# Altium schematic sheet pn532.SchDoc
size A4
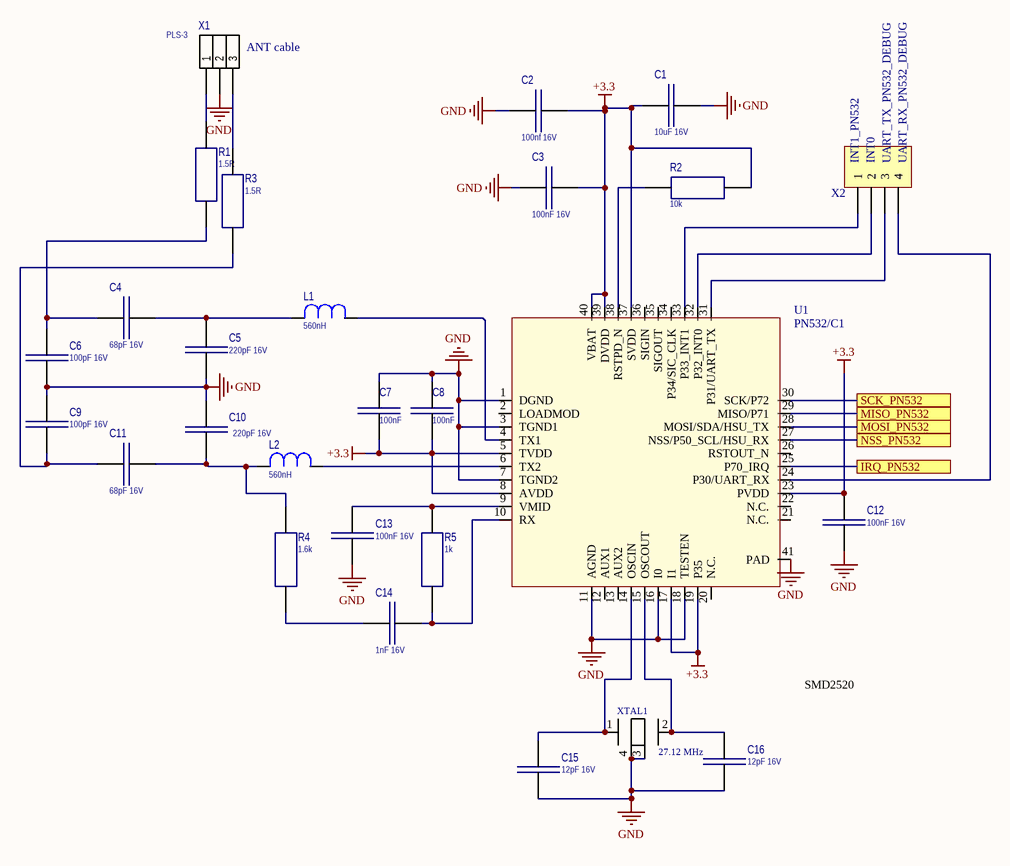
[diagram p0: pn532.SchDoc]

## Parts
C1  10uF 16V  [C_0805]
C2  100nf 16V  [C_0805]
C3  100nF 16V  [C_0805]
C4  68pF 16V  [C_0805]
C5  220pF 16V  [C_0805]
C6  100pF 16V  [C_0805]
C7  100nF  [C_0805]
C8  100nF  [C_0805]
C9  100pF 16V  [C_0805]
C10  220pF 16V  [C_0805]
C11  68pF 16V  [C_0805]
C12  100nF 16V  [C_0805]
C13  100nF 16V  [C_0805]
C14  1nF 16V  [C_0805]
C15  12pF 16V  [C_0805]
C16  12pF 16V  [C_0805]
L1  560nH  [L_0805]
L2  560nH  [L_0805]
R1  1.5R  [R_0805]
R2  10k  [R_0805]
R3  1.5R  [R_0805]
R4  1.6k  [R_0805]
R5  1k  [R_0805]
U1  PN532/C1  [NXP-HVQFN-40_L]
X1  PLS-3  [PLS-3-3D]
X2  PLS-4  [PLS-4-3D]  (value not drawn)
XTAL1  27.12 MHz  [NX2520SA]

## Ports
IRQ_PN532, MISO_PN532, MOSI_PN532, NSS_PN532, SCK_PN532

## Nets
+3.3: C1.2 C2.1 C3.1 C7.1 C8.1 C12.2 R2.1 U1.5(TVDD) U1.8(AVDD) U1.17(I1) U1.19(P35) U1.23(PVDD) U1.37(SVDD) U1.39(DVDD) U1.40(VBAT)
GND: C1.1 C2.2 C3.2 C5.1 C6.1 C7.2 C8.2 C9.2 C10.2 C12.1 C13.1 C15.1 C16.1 U1.1(DGND) U1.3(TGND1) U1.7(TGND2) U1.11(AGND) U1.16(I0) U1.18(TESTEN) U1.41(PAD) X1.2 XTAL1.3 XTAL1.4
IRQ_PN532: U1.25(P70_IRQ) ; port IRQ_PN532
MISO_PN532: U1.29(MISO/P71) ; port MISO_PN532
MOSI_PN532: U1.28(MOSI/SDA/HSU_TX) ; port MOSI_PN532
NSS_PN532: U1.27(NSS/P50_SCL/HSU_RX) ; port NSS_PN532
SCK_PN532: U1.30(SCK/P72) ; port SCK_PN532
NetC4_1: C4.1 C5.2 L1.1
NetC4_2: C4.2 C6.2 R1.1
NetC9_1: C9.1 C11.2 R3.1
NetC10_1: C10.1 C11.1 L2.1 R4.2
NetC13_2: C13.2 R5.2 U1.9(VMID)
NetC14_1: C14.1 R5.1 U1.10(RX)
NetC14_2: C14.2 R4.1
NetC15_2: C15.2 U1.14(OSCIN) XTAL1.1
NetC16_2: C16.2 U1.15(OSCOUT) XTAL1.2
NetL1_2: L1.2 U1.4(TX1)
NetL2_2: L2.2 U1.6(TX2)
NetR1_2: R1.2 X1.1
NetR2_2: R2.2 U1.38(RSTPD_N)
NetR3_2: R3.2 X1.3
NetU1_24: U1.24(P30/UART_RX) X2.4
NetU1_31: U1.31(P31/UART_TX) X2.3
NetU1_32: U1.32(P32_INT0) X2.2
NetU1_33: U1.33(P33_INT1) X2.1

Not connected (* = marked no-connect by the designer): U1 2(LOADMOD) 12(AUX1) 13(AUX2) 20(N.C.) 21(N.C.) 22(N.C.) 26(RSTOUT_N) 34(P34/SIC_CLK) 35(SIGOUT) 36(SIGIN)

## Notes on the sheet
- (near X1) ANT cable
- (near X2) INT1_PN532
- (near X2) INT0
- (near X2) UART_TX_PN532_DEBUG
- (near X2) UART_RX_PN532_DEBUG
- SMD2520

## Library data of the parts
C1-C16 = C0805: Capacitor
  C1: Value: 10uF 16V
  C2: Value: 100nf 16V
  C3 C12 C13: Value: 100nF 16V
  C4 C11: Value: 68pF 16V
  C5 C10: Value: 220pF 16V
  C6 C9: Value: 100pF 16V
  C7 C8: Value: 100nF
  C14: Value: 1nF 16V
  C15 C16: Value: 12pF 16V
L1 L2 = L0805: MLF2012DR56K; Value: 560nH
R1-R5 = R0805: Resistor
  R1 R3: Value: 1.5R
  R2: Value: 10k
  R4: Value: 1.6k
  R5: Value: 1k
X1 = PLS-3: Header, 3-Pin; LatestRevisionDate: 17-Jul-2002; LatestRevisionNote: Re-released for DXP Platform.; Publisher: Altium Limited
X2 = PLS-4: Header, 4-Pin; LatestRevisionDate: 17-Jul-2002; LatestRevisionNote: Re-released for DXP Platform.; Publisher: Altium Limited
XTAL1 = NX2520SA: Quartz; pin to pad: 2>3 3>2